# Altium schematic sheet RPL_POWER_3V3.SchDoc: Step-Down Switching Regulater +5VDC to +3V3DC
size A; Date: Dec 17, 2017; DrawnBy: Seyed Omid Hasanli; Revision: 1.0; SheetNumber: 4
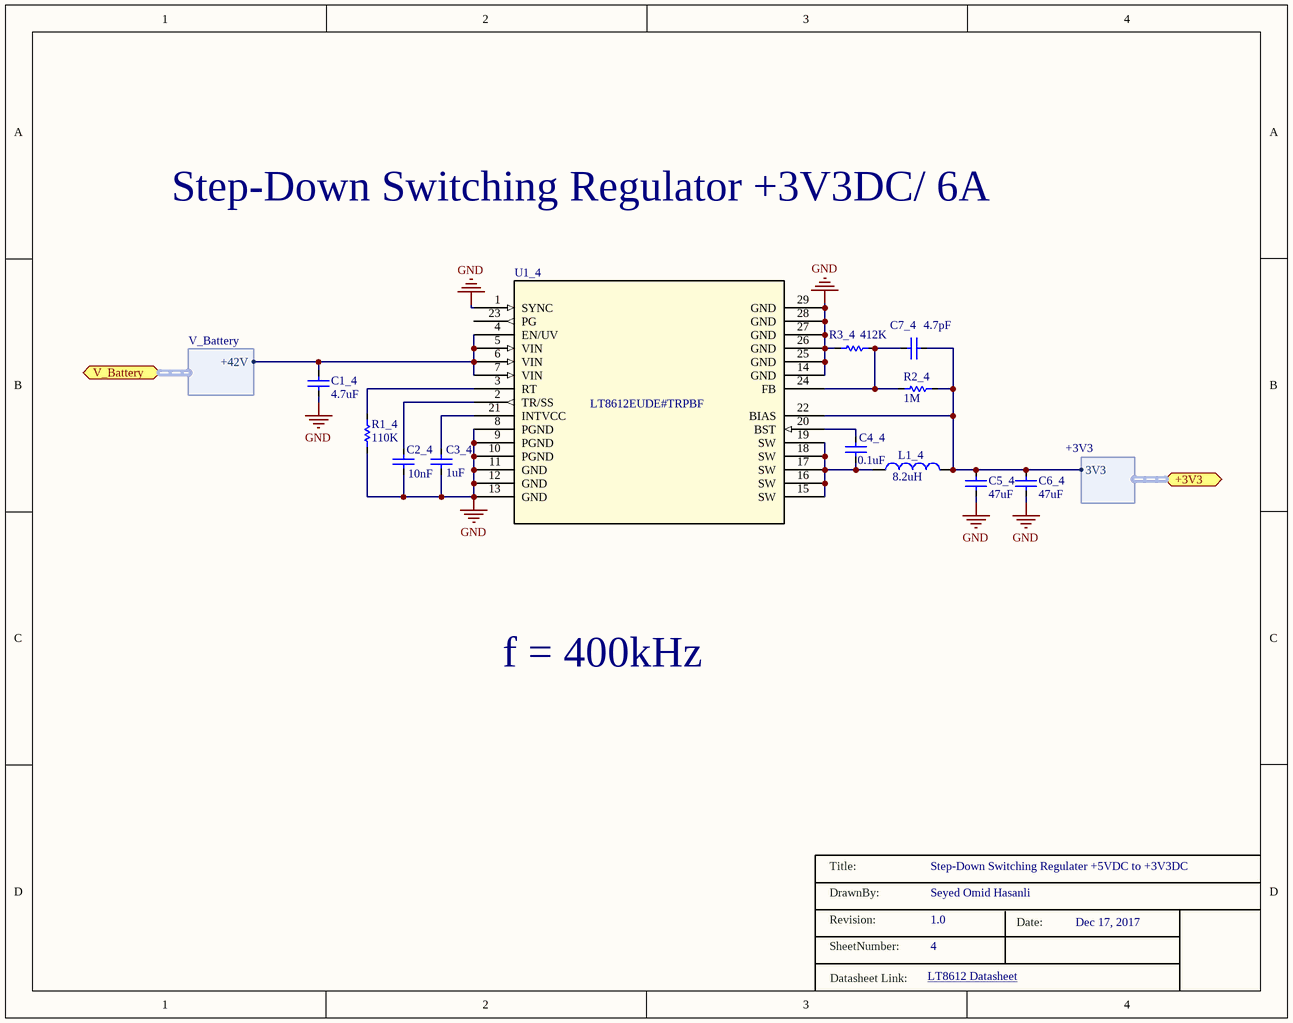
[diagram p0: RPL_POWER_3V3.SchDoc]

## Parts
C1_4  value 4.7uF  [C0805C475K9RACAUTO]  (hidden comment: Cap)
C2_4  value 10nF  [C0805C475K9RACAUTO]  (hidden comment: Cap)
C3_4  value 1uF  [C0805C475K9RACAUTO]  (hidden comment: Cap)
C4_4  value 0.1uF  [C0805C475K9RACAUTO]  (hidden comment: Cap)
C5_4  value 47uF  [C0805C475K9RACAUTO]  (hidden comment: Cap)
C6_4  value 47uF  [C0805C475K9RACAUTO]  (hidden comment: Cap)
C7_4  value 4.7pF  [C0805C475K9RACAUTO]  (hidden comment: Cap)
L1_4  value 8.2uH  [74404063082]  (hidden comment: Inductor)
R1_4  value 110K  [RES 0805]  (hidden comment: Res)
R2_4  value 1M  [RES 0805]  (hidden comment: Res)
R3_4  value 412K  [RES 0805]  (hidden comment: Res)
U1_4  LT8612EUDE#TRPBF  [QFN-28_UDE-M]

## Ports
+3V3 (harness +3V3), V_Battery (harness V_Battery)

## Harnesses
+3V3: 3V3
V_Battery: +42V

## Nets
GND: C1_4.1 C2_4.1 C3_4.1 C5_4.1 C6_4.1 R1_4.1 R3_4.2 U1_4.1(SYNC) U1_4.8(PGND) U1_4.9(PGND) U1_4.10(PGND) U1_4.11(GND) U1_4.12(GND) U1_4.13(GND) U1_4.14(GND) U1_4.25(GND) U1_4.26(GND) U1_4.27(GND) U1_4.28(GND) U1_4.29(GND)
NetC1_4_2: C1_4.2 U1_4.4(EN/UV) U1_4.5(VIN) U1_4.6(VIN) U1_4.7(VIN) ; port V_Battery.+42V
NetC2_4_2: C2_4.2 U1_4.2(TR/SS)
NetC3_4_2: C3_4.2 U1_4.21(INTVCC)
NetC4_4_1: C4_4.1 L1_4.1 U1_4.15(SW) U1_4.16(SW) U1_4.17(SW) U1_4.18(SW) U1_4.19(SW)
NetC4_4_2: C4_4.2 U1_4.20(BST)
NetC5_4_2: C5_4.2 C6_4.2 C7_4.2 L1_4.2 R2_4.2 U1_4.22(BIAS) ; port +3V3.3V3
NetC7_4_1: C7_4.1 R2_4.1 R3_4.1 U1_4.24(FB)
NetR1_4_2: R1_4.2 U1_4.3(RT)

Not connected (* = marked no-connect by the designer): U1_4 23(PG)

## Notes on the sheet
- Step-Down Switching Regulator +3V3DC/ 6A
- f = 400kHz
- LT8612 Datasheet <http://cds.linear.com/docs/en/datasheet/8612fa.pdf>
- Title:
- DrawnBy:
- Revision:
- SheetNumber:
- Date:
- Datasheet Link:

## Library data of the parts
U1_4 = LT8612EUDE#TRPBF: Imported; Vendor: Linear Technology; Manufacturer_Part_Number: lt8612eude#trpbf; Value: Value; Type: Type; RefDes: RefDes
L1_4 = Inductor: Link: https://www.mouser.com/ProductDetail/Wurth-Electronics/74404063082/?qs=%2fha2pyFaduht0%252bnypAtgtixkbhy4PvyoSkP3FX7V6mNeXEYnZyCHyA%3d%3d